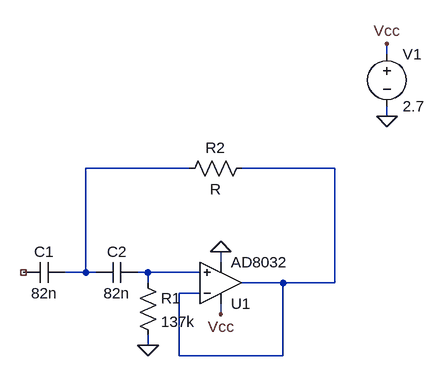
[diagram p0: schematic Draft1.asc]
Draft1.asc, the LTspice schematic file:
Version 4.1
SHEET 1 880 680
WIRE 336 0 336 -16
WIRE 336 96 336 80
WIRE 32 176 -128 176
WIRE 256 176 112 176
WIRE 80 320 80 304
WIRE -128 336 -128 176
WIRE -128 336 -160 336
WIRE -112 336 -128 336
WIRE -32 336 -48 336
WIRE 48 336 -32 336
WIRE -32 352 -32 336
WIRE 176 352 112 352
WIRE 256 352 256 176
WIRE 256 352 176 352
WIRE 48 368 16 368
WIRE 80 400 80 384
WIRE -32 448 -32 432
WIRE 16 464 16 368
WIRE 176 464 176 352
WIRE 176 464 16 464
FLAG 80 304 0
FLAG 336 96 0
FLAG 336 -16 Vcc
FLAG 80 400 Vcc
FLAG -32 448 0
SYMBOL OpAmps\\AD8032 80 416 M180
SYMATTR InstName U1
SYMBOL voltage 336 -16 R0
SYMATTR InstName V1
SYMATTR Value 2.7
SYMBOL cap -160 320 R90
WINDOW 0 0 32 VBottom 2
WINDOW 3 32 32 VTop 2
SYMATTR InstName C1
SYMATTR Value 82n
SYMBOL cap -48 320 R90
WINDOW 0 0 32 VBottom 2
WINDOW 3 32 32 VTop 2
SYMATTR InstName C2
SYMATTR Value 82n
SYMBOL res -48 336 R0
SYMATTR InstName R1
SYMATTR Value 137k
SYMBOL res 128 160 R90
WINDOW 0 0 56 VBottom 2
WINDOW 3 32 56 VTop 2
SYMATTR InstName R2

The netlist it stands for:
* Draft1.asc
X§U1 N003 N002 Vcc 0 N002 AD8032  ; pins In+ In- V+ V- OUT
V1 Vcc 0 2.7
C1 N001 NC_01 82n
C2 N003 N001 82n
R1 N003 0 137k
R2 N002 N001 R
.backanno
.end